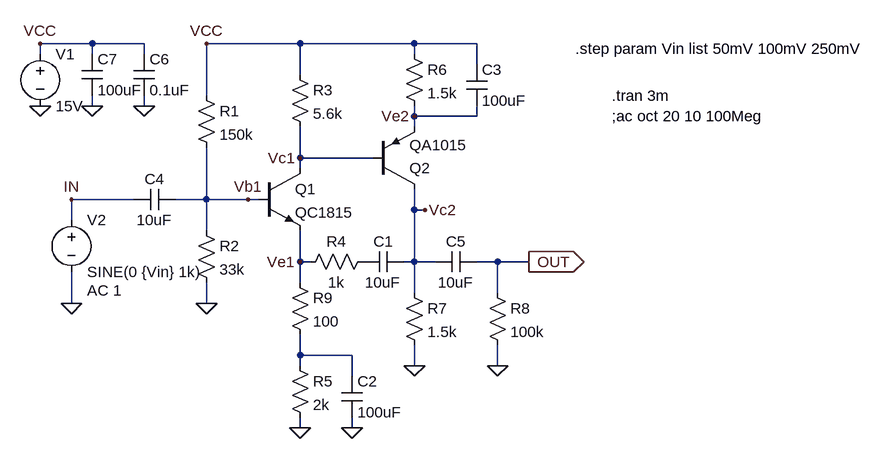
[diagram p0: schematic Negative FeedBack_In.asc]
Negative FeedBack_In.asc, the LTspice schematic file:
Version 4
SHEET 1 1264 680
WIRE 0 -64 -80 -64
WIRE 80 -64 0 -64
WIRE 320 -64 176 -64
WIRE 496 -64 320 -64
WIRE 592 -64 496 -64
WIRE -80 -48 -80 -64
WIRE 0 -48 0 -64
WIRE 80 -48 80 -64
WIRE 496 -48 496 -64
WIRE 592 -32 592 -64
WIRE 320 -16 320 -64
WIRE 176 16 176 -64
WIRE 0 32 0 16
WIRE 80 32 80 16
WIRE 496 48 496 32
WIRE 592 48 592 32
WIRE 592 48 496 48
WIRE 496 64 496 48
WIRE 320 112 320 64
WIRE 432 112 320 112
WIRE 320 128 320 112
WIRE 64 176 -32 176
WIRE 176 176 176 96
WIRE 176 176 128 176
WIRE 240 176 176 176
WIRE 256 176 240 176
WIRE 496 192 496 160
WIRE 512 192 496 192
WIRE -32 208 -32 176
WIRE 176 224 176 176
WIRE 320 272 320 224
WIRE 336 272 320 272
WIRE 496 272 496 192
WIRE 496 272 480 272
WIRE 528 272 496 272
WIRE 624 272 592 272
WIRE 672 272 624 272
WIRE 320 304 320 272
WIRE 496 320 496 272
WIRE 624 320 624 272
WIRE -32 336 -32 288
WIRE 176 336 176 304
WIRE 320 416 320 384
WIRE 400 416 320 416
WIRE 320 432 320 416
WIRE 496 432 496 400
WIRE 624 432 624 400
WIRE 400 448 400 416
WIRE 320 528 320 512
WIRE 400 528 400 512
FLAG 320 528 0
FLAG 400 528 0
FLAG 176 336 0
FLAG 496 432 0
FLAG 176 -64 VCC
FLAG -80 -64 VCC
FLAG -80 32 0
FLAG 624 432 0
FLAG 672 272 OUT
IOPIN 672 272 Out
FLAG -32 336 0
FLAG -32 176 IN
FLAG 240 176 Vb1
FLAG 320 272 Ve1
FLAG 320 112 Vc1
FLAG 512 192 Vc2
FLAG 496 48 Ve2
FLAG 0 32 0
FLAG 80 32 0
SYMBOL res 160 0 R0
SYMATTR InstName R1
SYMATTR Value 150k
SYMBOL res 160 208 R0
SYMATTR InstName R2
SYMATTR Value 33k
SYMBOL res 304 -32 R0
SYMATTR InstName R3
SYMATTR Value 5.6k
SYMBOL res 432 256 R90
WINDOW 0 0 56 VBottom 2
WINDOW 3 32 56 VTop 2
SYMATTR InstName R4
SYMATTR Value 1k
SYMBOL res 304 416 R0
SYMATTR InstName R5
SYMATTR Value 2k
SYMBOL cap 480 256 R90
WINDOW 0 0 32 VBottom 2
WINDOW 3 32 32 VTop 2
SYMATTR InstName C1
SYMATTR Value 10uF
SYMBOL cap 384 448 R0
SYMATTR InstName C2
SYMATTR Value 100uF
SYMBOL res 480 -64 R0
SYMATTR InstName R6
SYMATTR Value 1.5k
SYMBOL cap 576 -32 R0
SYMATTR InstName C3
SYMATTR Value 100uF
SYMBOL res 480 304 R0
SYMATTR InstName R7
SYMATTR Value 1.5k
SYMBOL voltage -80 -64 R0
WINDOW 123 0 0 Left 2
WINDOW 39 0 0 Left 2
SYMATTR InstName V1
SYMATTR Value 15V
SYMBOL cap 128 160 R90
WINDOW 0 0 32 VBottom 2
WINDOW 3 32 32 VTop 2
SYMATTR InstName C4
SYMATTR Value 10uF
SYMBOL cap 592 256 R90
WINDOW 0 0 32 VBottom 2
WINDOW 3 32 32 VTop 2
SYMATTR InstName C5
SYMATTR Value 10uF
SYMBOL res 608 304 R0
SYMATTR InstName R8
SYMATTR Value 100k
SYMBOL res 304 288 R0
SYMATTR InstName R9
SYMATTR Value 100
SYMBOL voltage -32 192 R0
WINDOW 123 24 124 Left 2
WINDOW 39 0 0 Left 2
SYMATTR Value2 AC 1
SYMATTR InstName V2
SYMATTR Value SINE(0 {Vin} 1k)
SYMBOL npn 256 128 R0
SYMATTR InstName Q1
SYMATTR Value QC1815
SYMBOL pnp 432 160 M180
SYMATTR InstName Q2
SYMATTR Value QA1015
SYMBOL cap 64 -48 R0
SYMATTR InstName C6
SYMATTR Value 0.1uF
SYMBOL cap -16 -48 R0
SYMATTR InstName C7
SYMATTR Value 100uF
TEXT 800 16 Left 2 !.tran 3m
TEXT 744 -56 Left 2 !.step param Vin list 50mV 100mV 250mV
TEXT 800 48 Left 2 !;ac oct 20 10 100Meg

The netlist it stands for:
* Negative FeedBack_In.asc
R1 VCC Vb1 150k
R2 Vb1 0 33k
R3 VCC Vc1 5.6k
R4 P001 Ve1 1k
R5 N001 0 2k
C1 Vc2 P001 10uF
C2 N001 0 100uF
R6 VCC Ve2 1.5k
C3 VCC Ve2 100uF
R7 Vc2 0 1.5k
V1 VCC 0 15V
C4 Vb1 IN 10uF
C5 OUT Vc2 10uF
R8 OUT 0 100k
R9 Ve1 N001 100
V2 IN 0 SINE(0 {Vin} 1k) AC 1
Q1 Vc1 Vb1 Ve1 0 QC1815
Q2 Vc2 Vc1 Ve2 0 QA1015
C6 VCC 0 0.1uF
C7 VCC 0 100uF
.model NPN NPN
.model PNP PNP
.lib standard.bjt
.tran 3m
.step param Vin list 50mV 100mV 250mV
;ac oct 20 10 100Meg
.backanno
.end